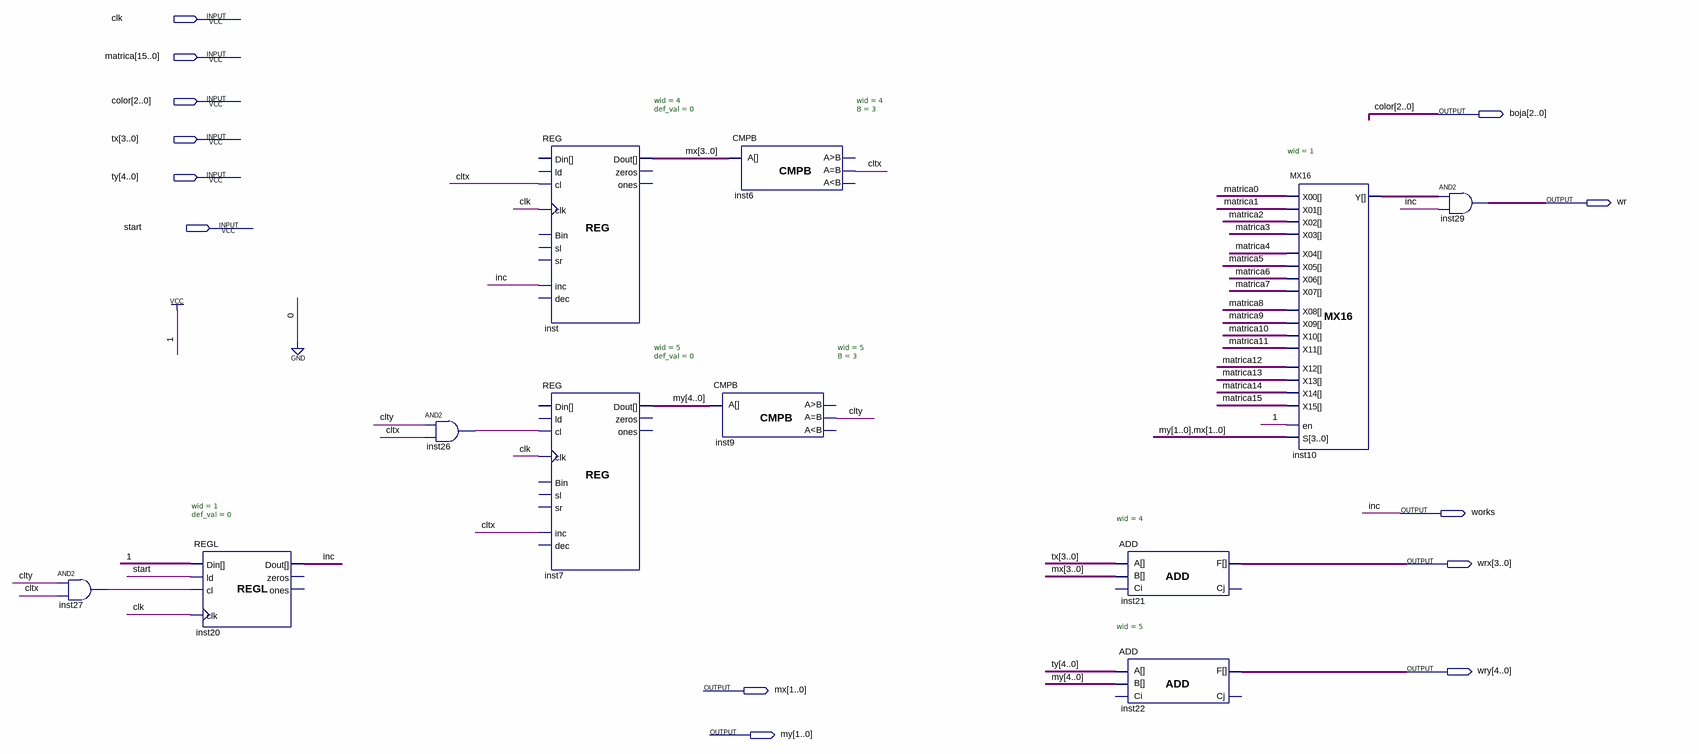
[diagram p0: schematic sheet]
// Quartus schematic upistetrimin.bdf as structural Verilog: 11 symbols, 13 pins
module upistetrimin (
  input  clk,
  input  [15:0] matrica,
  input  [2:0] color,
  input  [3:0] tx,
  input  [4:0] ty,
  input  start,
  output [2:0] boja,
  output wr,
  output works,
  output [3:0] wrx,
  output [4:0] wry,
  output [3:0] mx,
  output [4:0] my
);

  wire cltx, clty, inst10_y, inst26_out, inst27_out;

  and inst27 (inst27_out, clty, cltx);
  REGL #(.wid(1), .def_val(0)) inst20 (
    .Din(1'b1), .ld(start), .cl(inst27_out), .clk(clk), .Dout(works));  // open: zeros, ones
  and inst26 (inst26_out, clty, cltx);
  REG #(.wid(4), .def_val(0)) inst (
    .cl(cltx), .clk(clk), .inc(works), .Dout(mx));  // open: ld, Bin, sl, sr, dec, Din, zeros, ones
  REG #(.wid(5), .def_val(0)) inst7 (
    .cl(inst26_out), .clk(clk), .inc(cltx), .Dout(my));  // open: ld, Bin, sl, sr, dec, Din, zeros, ones
  CMPB #(.wid(5), .B(3)) inst9 (.A(my), .eq(clty));  // open: gr, ls
  CMPB #(.wid(4), .B(3)) inst6 (.A(mx), .eq(cltx));  // open: gr, ls
  ADD #(.wid(4)) inst21 (.A(tx), .B(mx), .F(wrx));  // open: Ci, Cj
  ADD #(.wid(5)) inst22 (.A(ty), .B(my), .F(wry));  // open: Ci, Cj
  MX16 #(.wid(1)) inst10 (
    .X00(matrica[0]), .X01(matrica[1]), .X02(matrica[2]), .X03(matrica[3]), .X04(matrica[4]),
    .X05(matrica[5]), .X06(matrica[6]), .X07(matrica[7]), .X08(matrica[8]), .X09(matrica[9]),
    .X10(matrica[10]), .X11(matrica[11]), .X12(matrica[12]), .X13(matrica[13]), .X14(matrica[14]),
    .X15(matrica[15]), .en(1'b1), .S({my[1:0], mx[1:0]}), .Y(inst10_y));
  and inst29 (wr, inst10_y, works);

  assign boja = color;

  // Other names for the same wires on the sheet: inc = works
endmodule
